# EAGLE design DOT-plus-SHIM (EAGLE 9.6.2)
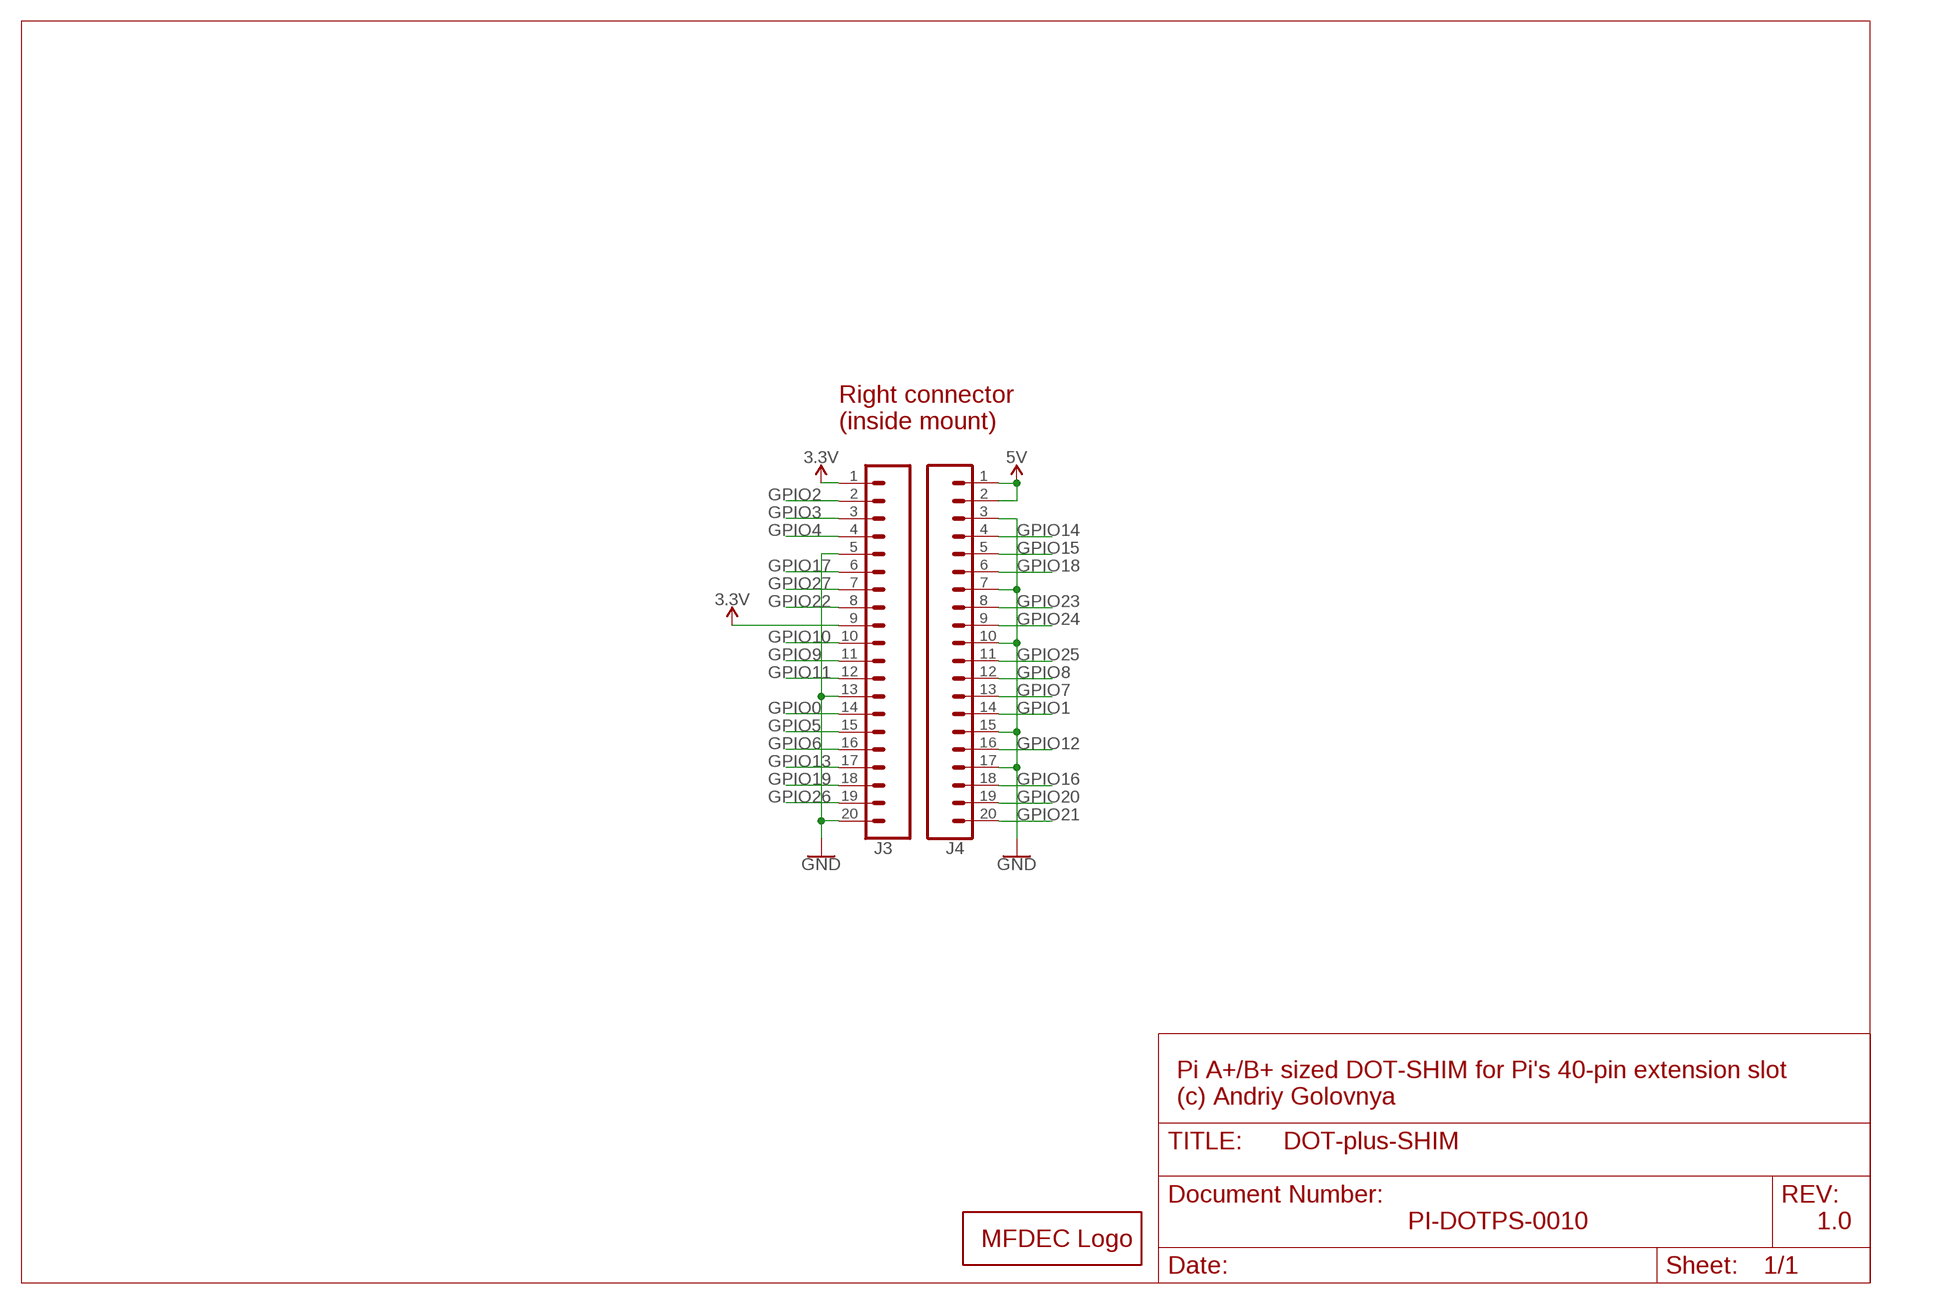
[diagram p0: schematic, sheet 1]

## Parts
J3  CONN_20LOCK  [1X20_LOCK]
J4  CONN_20LOCK  [1X20_LOCK]
LOGO1  MFDECLOGO_L_40MM  [MFDEC_L_40MM]

## Nets
3.3V: J3.1 J3.9
5V: J4.1 J4.2
GND: J3.5 J3.13 J3.20 J4.3 J4.7 J4.10 J4.15 J4.17
GPIO0: J3.14
GPIO1: J4.14
GPIO2: J3.2
GPIO3: J3.3
GPIO4: J3.4
GPIO5: J3.15
GPIO6: J3.16
GPIO7: J4.13
GPIO8: J4.12
GPIO9: J3.11
GPIO10: J3.10
GPIO11: J3.12
GPIO12: J4.16
GPIO13: J3.17
GPIO14: J4.4
GPIO15: J4.5
GPIO16: J4.18
GPIO17: J3.6
GPIO18: J4.6
GPIO19: J3.18
GPIO20: J4.19
GPIO21: J4.20
GPIO22: J3.8
GPIO23: J4.8
GPIO24: J4.9
GPIO25: J4.11
GPIO26: J3.19
GPIO27: J3.7

## Notes on the sheet
- Right connector
  (inside mount)
- Pi A+/B+ sized DOT-SHIM for Pi's 40-pin extension slot
  (c) Andriy Golovnya
- PI-DOTPS-0010 | 1.0

## Library data of the parts
J3 J4 = _my_locked_connectors:CONN_20: Multi connection point. Often used as Generic Header-pin footprint for 0.1 inch spaced/style header connections On any of the 0.1 inch spaced packages, you can populate with these: Break Away Headers - Straight <https://www.sparkfun.com/products/116> (PRT-00116) Break Away Male Headers - Right Angle <https://www.sparkfun.com/products/553> (PRT-00553) Female Headers <https://www.sparkfun.com/products/115> (PRT-00115) Break Away Headers - Machine Pin <https://www.sparkfun.com/products/117> (PRT-00117) Break Away Female Headers - Swiss Machine Pin <https://www.sparkfun.com/products/743> (PRT-00743) For SCREWTERMINALS and SPRING TERMINALS visit here: Screw Terimnals on SparkFun.com <https://www.sparkfun.com/search/results?term=Screw+Terminals> (5mm/3.5mm/2.54mm spacing) This device is also useful as a general connection point to wire up your design to another part of your project. Our various solder wires solder well into these plated through hole pads. Hook-Up Wire - Assortment (Stranded, 22 AWG) <https://www.sparkfun.com/products/11375> (PRT-11375) Hook-Up Wire - Assortment (Solid Core, 22 AWG) <https://www.sparkfun.com/products/11367> (PRT-11367) View the entire wire category on our website here <https://www.sparkfun.com/categories/141> Special notes: Molex polarized connector foot print use with SKU : PRT-08231 with associated crimp pins and housings. 1MM SMD Version SKU: PRT-10208 NOTES ON THE VARIANTS LOCK and LOCK_LONGPADS... This footprint was designed to help hold the alignment of a through-hole component (i.e. 6-pin header) while soldering it into place. You may notice that each hole has been shifted either up or down by 0.005 of an inch from it's more standard position (which is a perfectly straight line). This slight alteration caused the pins (the squares in the middle) to touch the edges of the holes. Because they are alternating, it causes a "brace" to hold the component in place. 0.005 has proven to be the perfect amount of "off-center" position when using our standard breakaway headers. Although looks a little odd when you look at the bare footprint, once you have a header in there, the alteration is very hard to notice. Also,if you push a header all the way into place, it is covered up entirely on the bottom side. Note about LOCK SPECIAL package: This is just like the LOCK variant in that the holes are staggared by 5 mil, but except for the last two holes. They are not altered from the "standard" footprint layout. This is used for a special purpose on the layout of our Graphic LCD Backpack. Make sure you want to use this device before selecting it for you project!
LOGO1 = _my_logos:MFDECLOGO: Midnight Fog - Digital Eye Candy LOGO

## Board
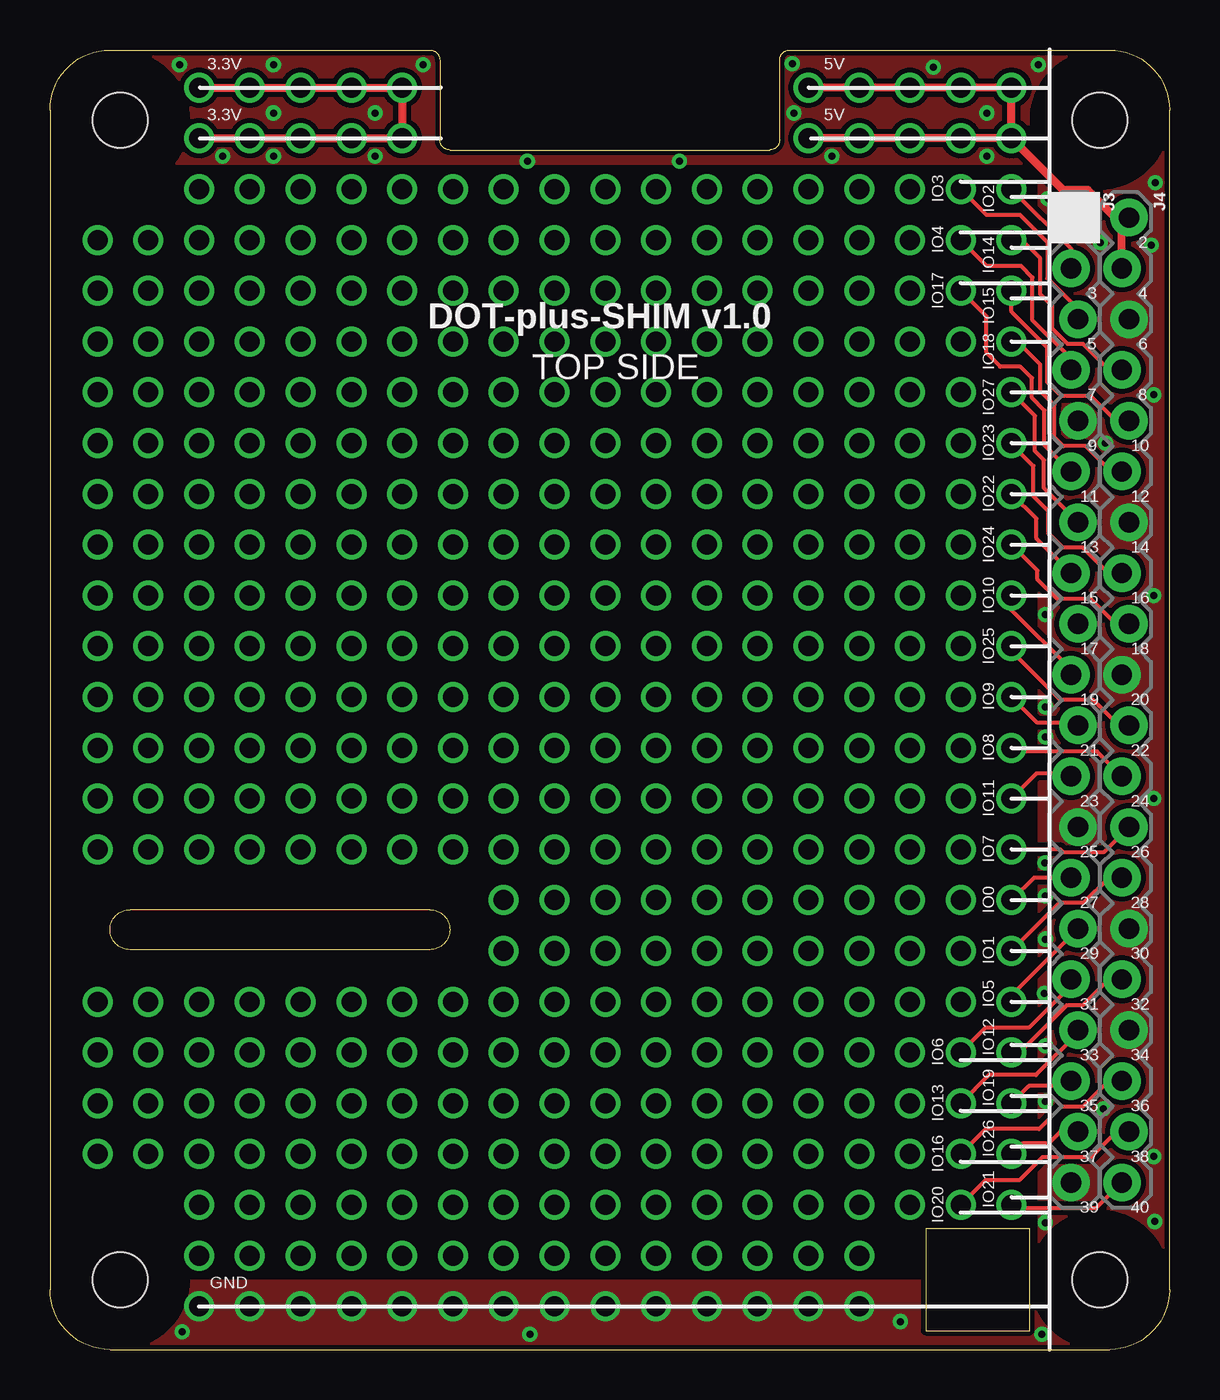
[diagram p1: board, top side]
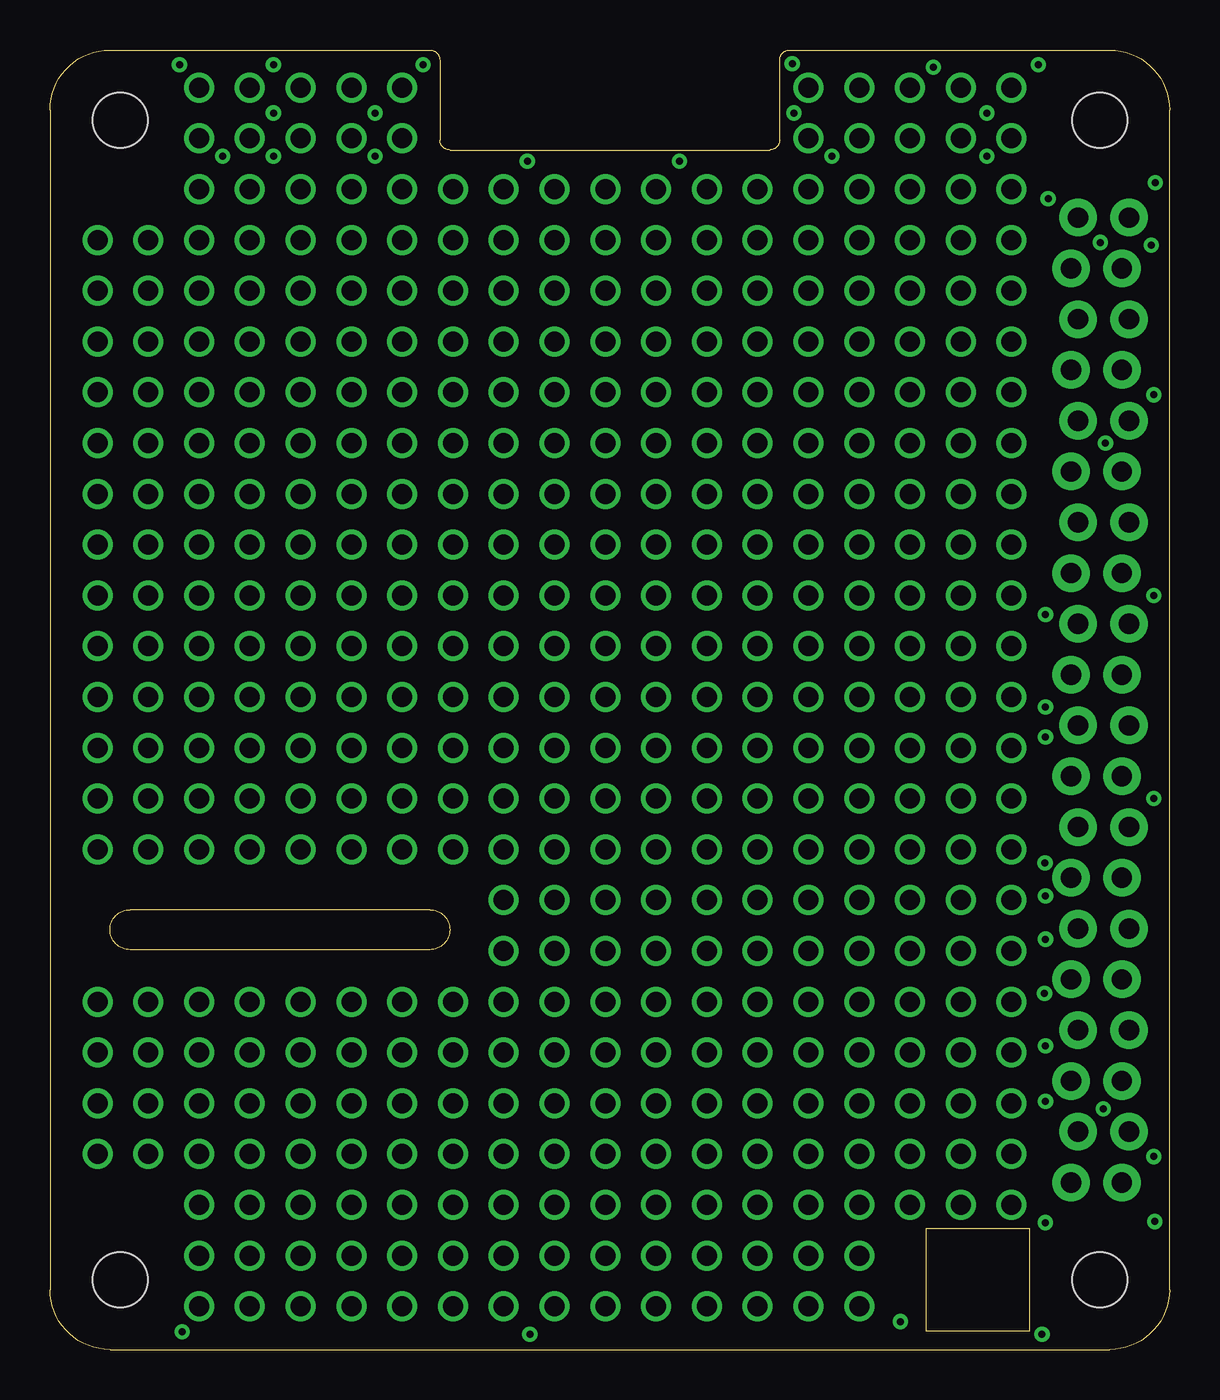
[diagram p2: board, inner layer Route2]
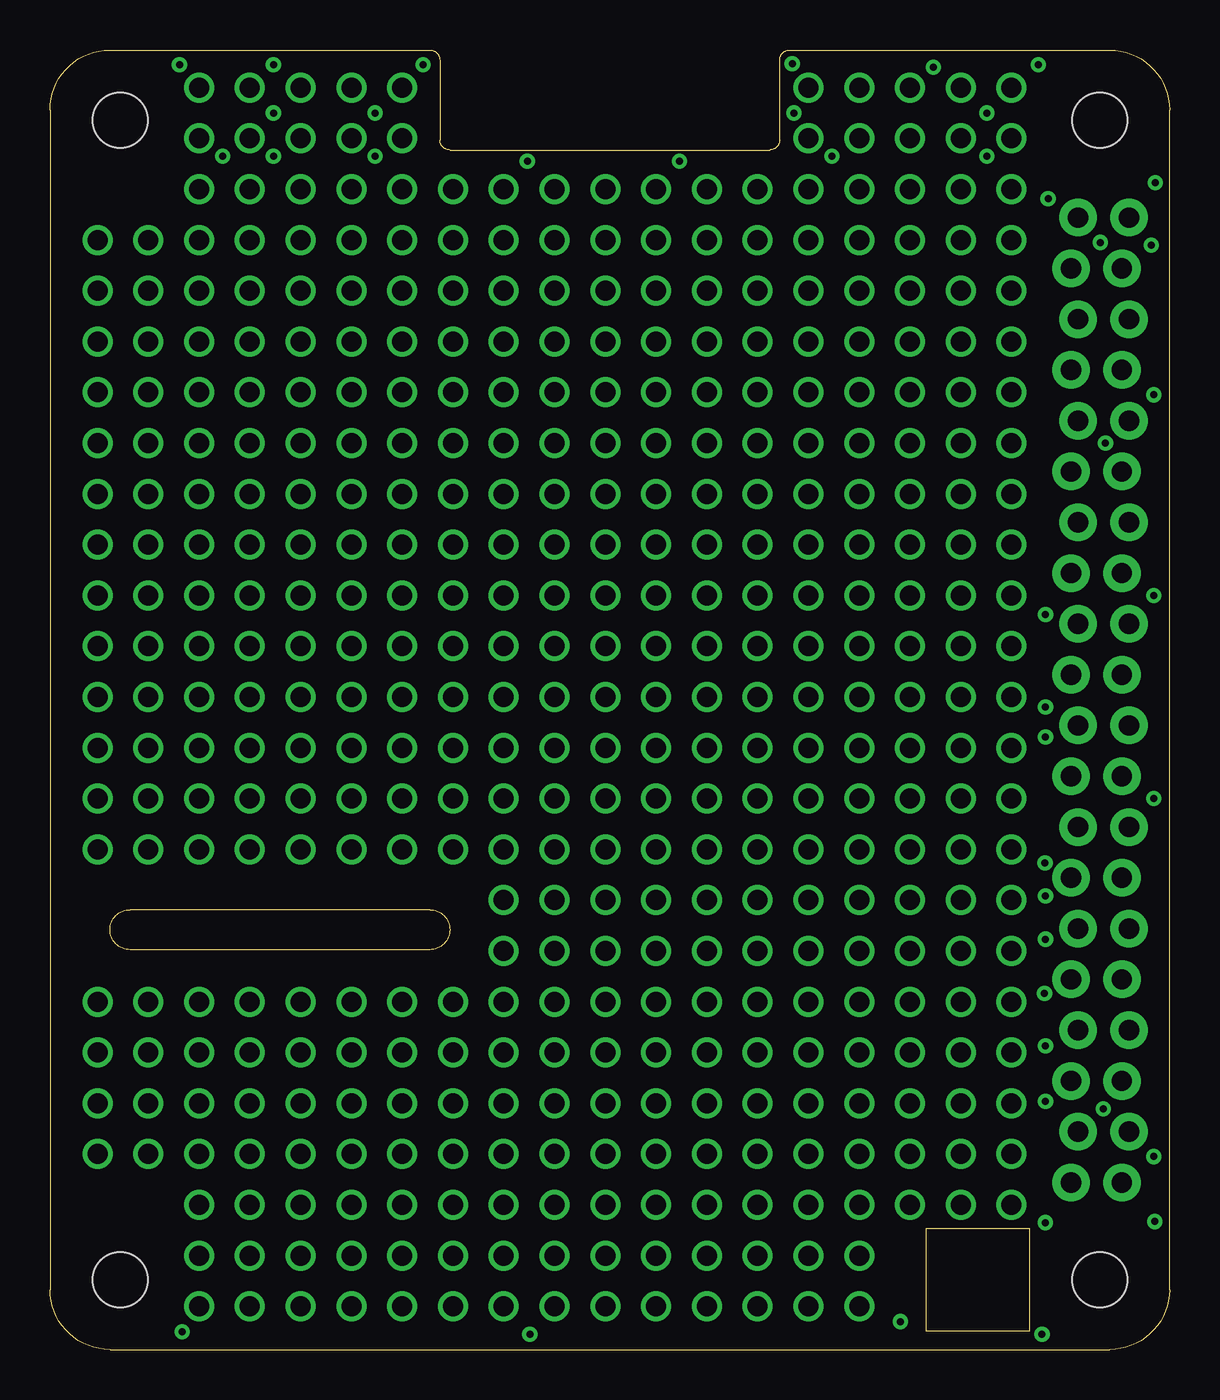
[diagram p3: board, inner layer Route15]
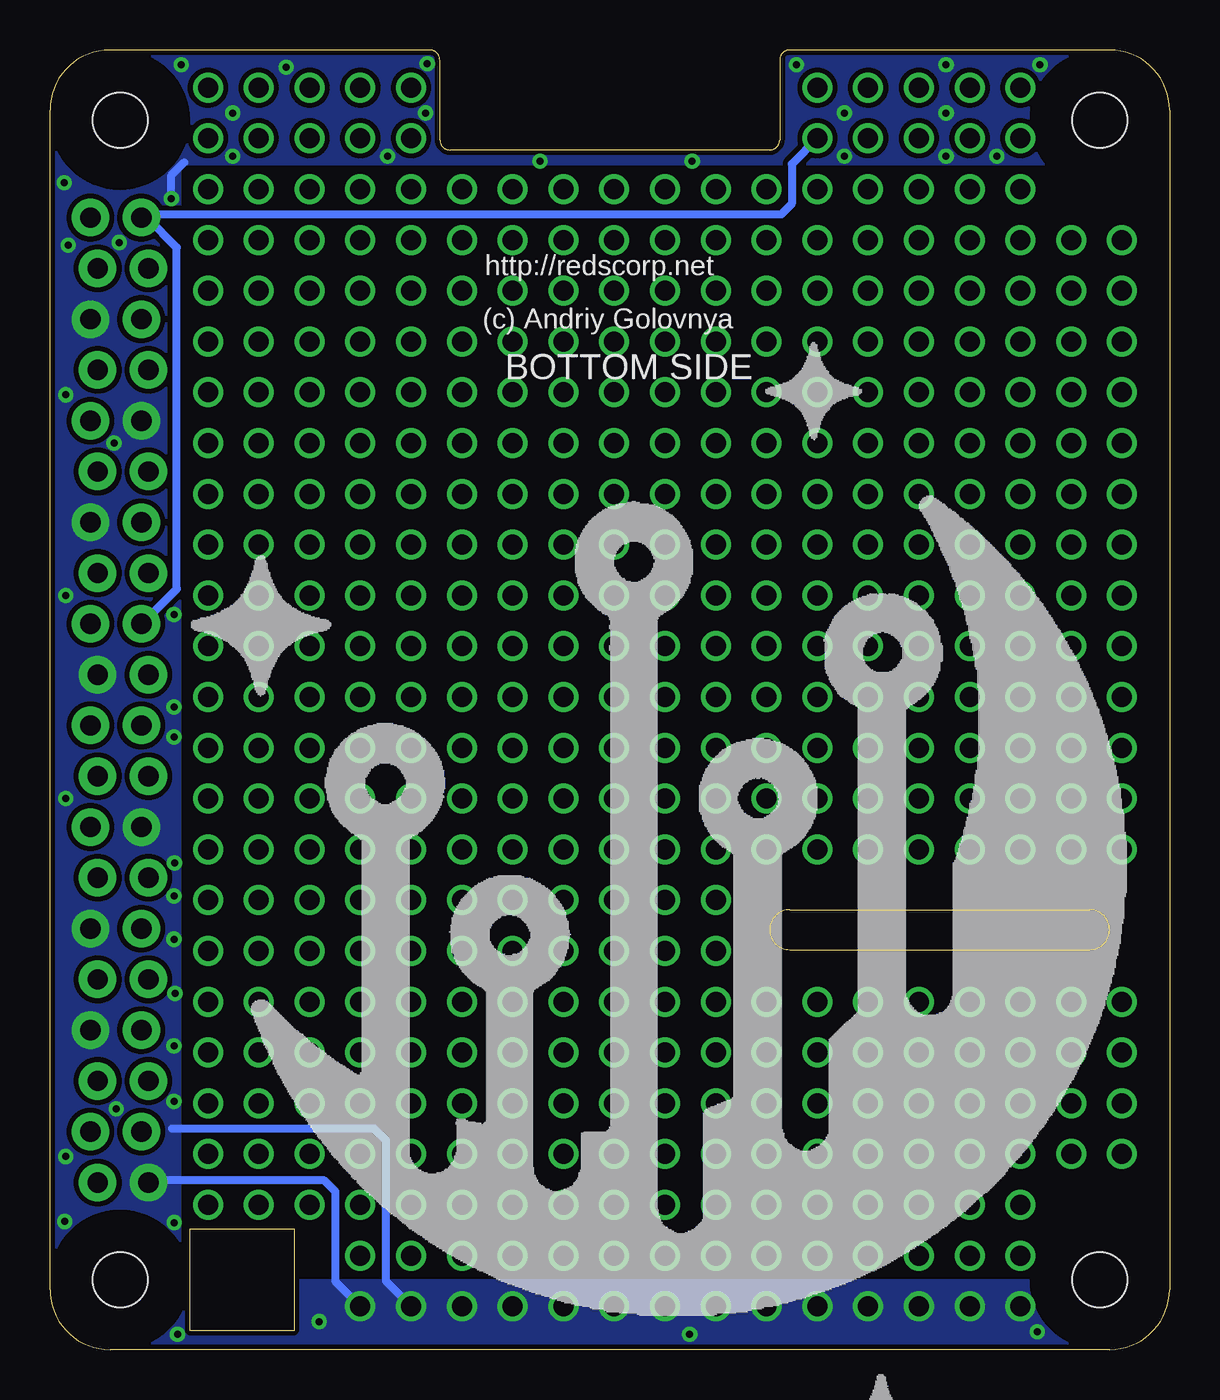
[diagram p4: board, bottom side, seen from below]

Size 56 x 65 mm. Coordinates in mm from the lower left corner, seen from the top.
Outline: 3,0 53,0 arc90 56,3 56,62 arc90 53,65 37,65 arc90 36.5,64.5 36.5,60.5 arc-90 36,60 20,60 arc-90 19.5,60.5 19.5,64.5 arc90 19,65 3,65 arc90 0,62 0,3 arc90 3,0
Outline: 43.8,0.95 49,0.95 49,6.05 43.8,6.05 43.8,0.95
Outline: 19,20 4,20 arc-180 4,22 19,22 arc-180 19,20
Copper layers (1*16): Top 0.035mm / dielectric 1.5mm / Bottom 0.035mm
Design rules "default *": minimum track width 6mil, minimum drill 0.35mm, track to track 6mil, track to pad 6mil, pad to pad 6mil, via to via 6mil, smd to smd 6mil, copper to edge 6mil, drill to drill 6mil, minimum pad ring 10mil, minimum via ring 8mil, stop-mask expansion 4mil, vias tented up to drill 20mil, thermal gap 10mil
Holes 2.75 mm at 3.5,3.5 52.5,3.5 3.5,61.5 52.5,61.5

### Footprints (pad centres in the part's own frame; a part is rotated, then mirrored left to right if it is on the bottom)
1X20_LOCK = drill 1.016 pad 1.88: 1 0,0.178; 2 2.54,-0.178; 3 5.08,0.178; 4 7.62,-0.178; 5 10.16,0.178; 6 12.7,-0.178; 7 15.24,0.178; 8 17.78,-0.178; 9 20.32,0.178; 10 22.86,-0.178; 11 25.4,0.178; 12 27.94,-0.178; 13 30.48,0.178; 14 33.02,-0.178; 15 35.56,0.178; 16 38.1,-0.178; 17 40.64,0.178; 18 43.18,-0.178; 19 45.72,0.178; 20 48.26,-0.178

### Placement (x,y rotation side)
J3  51.25,56.62 270 top
J4  53.79,56.62 270 top
LOGO1  -1.52,-10.03 90 bottom  (outside the outline)

### Tracks (layer width: path | path; a pad name or v marks a point on that pad's centre or on a via)
3.3V  (via drill 1)
  Top 0.406: v7.46,63.12 v10,63.12 v12.54,63.12 v15.08,63.12 v17.62,63.12 v17.62,60.58 v15.08,60.58 v12.54,60.58 v10,60.58 v7.46,60.58
  Bottom 0.406: J3.9 51.4,36.3 49.65,38.04 49.65,55.12 51.15,56.62 J3.1 51.28,56.77 19.43,56.77 18.9,57.3 18.9,59.3 v17.62,60.58
5V  (via drill 1)
  Top 0.406: J4.2 53.62,56.26 J4.1 53.29,56.62 51.91,57.99 50.69,57.99 v48.1,60.58 | v48.1,60.58 v45.56,60.58 v43.02,60.58 v40.48,60.58 v37.94,60.58 | v48.1,60.58 v48.1,63.12 v45.56,63.12 v43.02,63.12 v40.48,63.12 v37.94,63.12
GND  (via drill 0.35, 1)
  Bottom 0.406: v40.48,2.16 41.73,3.42 41.73,7.9 42.32,8.48 50.95,8.48 J3.20 | v37.94,2.16 39.19,3.41 39.19,10.46 39.78,11.05 49.91,11.05 | v49.93,57.56 49.93,58.73 49.28,59.38
  other vias: 30.32,2.16 27.78,2.16 25.24,2.16 22.7,2.16 20.16,2.16 17.62,2.16 15.08,2.16 32.86,2.16 35.4,2.16 7.46,2.16 10,2.16 12.54,2.16 55.26,6.4 49.62,0.76 49.44,64.26 55.29,58.37 37.13,64.31 49.8,36.75 49.8,30.63 49.8,22.68 49.8,20.52 49.8,15.19 52.54,55.37 52.8,45.34 52.7,12.04 55.08,55.24 55.21,47.75 55.21,37.72 55.21,27.56 55.21,9.65 49.8,32.13 49.77,24.33 49.75,17.81 49.8,12.42 37.21,61.85 39.12,59.69 46.86,61.85 46.86,59.69 44.2,64.14 6.48,64.26 8.64,59.69 16.26,61.85 18.67,64.26 16.26,59.69 11.18,61.85 11.18,64.26 11.18,59.69 31.5,59.44 23.88,59.44 6.6,0.89 42.55,1.4 24,0.76 49.78,6.35
  pour Top (isolate 0.254, no thermals): 49.49,59.31 -0.04,59.31 -0.04,65.15 56.23,65.15 56.23,0 -0.04,0 -0.04,3.43 49.49,3.43
  pour Bottom (isolate 0.254, no thermals): -0.04,59.31 -0.04,65.15 56.23,65.15 56.23,0 -0.04,0 -0.04,3.43 49.49,3.43 49.49,59.31
GND1
  cutout Top: 52.5,0 arc-180 52.5,7 arc-180
  cutout Route2: 52.5,0 arc-180 52.5,7 arc-180
  cutout Route15: 52.5,0 arc-180 52.5,7 arc-180
  cutout Bottom: 52.5,0 arc-180 52.5,7 arc-180
GND2
  cutout Top: 3.5,58 arc-180 3.5,65 arc-180
  cutout Route2: 3.5,58 arc-180 3.5,65 arc-180
  cutout Route15: 3.5,58 arc-180 3.5,65 arc-180
  cutout Bottom: 3.5,58 arc-180 3.5,65 arc-180
GND3
  cutout Top: 52.5,58 arc-180 52.5,65 arc-180
  cutout Route2: 52.5,58 arc-180 52.5,65 arc-180
  cutout Route15: 52.5,58 arc-180 52.5,65 arc-180
  cutout Bottom: 52.5,58 arc-180 52.5,65 arc-180
GND4
  cutout Top: 3.5,0 arc-180 3.5,7 arc-180
  cutout Route2: 3.5,0 arc-180 3.5,7 arc-180
  cutout Route15: 3.5,0 arc-180 3.5,7 arc-180
  cutout Bottom: 3.5,0 arc-180 3.5,7 arc-180
GPIO0  (via drill 1)
  Top 0.203: J3.14 49.21,23.59 v48.1,22.48
GPIO1  (via drill 1)
  Top 0.203: J4.14 52.96,23.59 51.69,22.33 50.49,22.33 v48.1,19.94
GPIO2  (via drill 1)
  Top 0.203: v48.1,58.04 51.08,55.06 J3.2
GPIO3  (via drill 1)
  Top 0.203: v45.56,58.04 46.84,56.76 48.51,56.76 49.88,55.39 49.88,53.58 51.43,52.03 J3.3
GPIO4  (via drill 1)
  Top 0.203: J3.4 51.08,49.55 49.15,51.48 49.15,53.62 48.58,54.19 46.87,54.19 v45.56,55.5
GPIO5  (via drill 1)
  Top 0.203: J3.15 48.1,17.72 v48.1,17.4
GPIO6  (via drill 1)
  Top 0.203: J3.16 51.08,18.21 48.96,16.09 46.79,16.09 v45.56,14.86
GPIO7  (via drill 1)
  Top 0.203: v48.1,25.02 50.53,25.02 50.68,24.86 52.7,24.86 J4.13
GPIO8  (via drill 1)
  Top 0.203: v48.1,30.1 v48.1,30.09 48.27,29.92 52.37,29.92 J4.12
GPIO9  (via drill 1)
  Top 0.203: J3.11 51.3,31.34 49.39,31.34 v48.1,32.64
GPIO10  (via drill 1)
  Top 0.203: v48.1,37.72 48.1,36.99 51.08,34.01 J3.10
GPIO11  (via drill 1)
  Top 0.203: J3.12 50.95,28.8 49.34,28.8 v48.1,27.56
GPIO12  (via drill 1)
  Top 0.203: J4.16 52.96,18.52 51.66,17.22 50.86,17.22 48.5,14.86 v48.1,14.86
GPIO13  (via drill 1)
  Top 0.203: J3.17 51.43,15.85 49.31,13.73 46.97,13.73 v45.56,12.32
GPIO14  (via drill 1)
  Top 0.203: v48.1,55.5 48.61,55.5 49.53,54.58 49.53,52.8 50.13,52.2 50.13,51.07 50.91,50.29 51.69,50.29 52.98,48.99 J4.4
GPIO15  (via drill 1)
  Top 0.203: J4.5 53.31,46.45 52.07,47.7 50.58,47.7 49.88,48.4 49.88,50.12 48.1,51.9 v48.1,52.96
GPIO16  (via drill 1)
  Top 0.203: J4.18 52.96,13.44 51.66,12.14 50.58,12.14 49.48,11.04 46.82,11.04 v45.56,9.78
GPIO17  (via drill 1)
  Top 0.203: J3.6 49.75,45.24 49.75,46.97 49.11,47.61 49.11,48.59 48.54,49.16 47.53,49.16 46.84,49.85 46.84,51.68 v45.56,52.96
GPIO18  (via drill 1)
  Top 0.203: v48.1,50.42 48.38,50.42 49.52,49.28 49.52,47.96 50.24,47.24 50.24,45.63 50.68,45.19 51.81,45.19 53.08,43.91 J4.6
GPIO19  (via drill 1)
  Top 0.203: J3.18 50.82,13.18 48.97,13.18 v48.11,12.32 v48.1,12.32
GPIO20  (via drill 1)
  Top 0.203: J4.19 53.34,10.89 52.07,9.62 49.64,9.62 48.49,8.47 46.79,8.47 v45.56,7.24
GPIO21  (via drill 1)
  Top 0.203: v48.1,7.24 48.28,7.06 52.32,7.06 J4.20
GPIO22  (via drill 1)
  Top 0.203: J3.8 49.34,40.57 49.34,41.55 v48.1,42.8
GPIO23  (via drill 1)
  Top 0.203: J4.8 52.93,38.84 51.66,40.1 50.66,40.1 49.93,40.83 49.93,41.94 49.19,42.68 49.19,44.2 48.1,45.29 v48.1,45.34
GPIO24  (via drill 1)
  Top 0.203: J4.9 53.31,36.3 52.07,37.54 50.38,37.54 49.4,38.52 49.4,38.96 v48.1,40.26
GPIO25  (via drill 1)
  Top 0.203: J4.11 53.46,31.21 52.19,32.48 50.53,32.48 48.1,34.91 v48.1,35.17 v48.1,35.18
GPIO26  (via drill 1)
  Top 0.203: J3.19 50.54,10.89 49.95,10.31 48.63,10.31 v48.1,9.78
GPIO27  (via drill 1)
  Top 0.203: J3.7 49.72,43.08 49.72,44.48 49.27,44.94 49.27,46.71 v48.1,47.88
N$1  (via drill 1)
  other vias: 25.24,7.24
N$2  (via drill 1)
  other vias: 25.24,9.78
N$3  (via drill 1)
  other vias: 25.24,12.32
N$4  (via drill 1)
  other vias: 25.24,14.86
N$5  (via drill 1)
  other vias: 25.24,17.4
N$6  (via drill 1)
  other vias: 25.24,19.94
N$7  (via drill 1)
  other vias: 25.24,22.48
N$8  (via drill 1)
  other vias: 25.24,25.02
N$9  (via drill 1)
  other vias: 25.24,27.56
N$10  (via drill 1)
  other vias: 25.24,30.1
N$11  (via drill 1)
  other vias: 25.24,32.64
N$12  (via drill 1)
  other vias: 25.24,35.18
N$13  (via drill 1)
  other vias: 25.24,37.72
N$14  (via drill 1)
  other vias: 25.24,40.26
N$15  (via drill 1)
  other vias: 25.24,42.8
N$16  (via drill 1)
  other vias: 25.24,45.34
N$17  (via drill 1)
  other vias: 25.24,47.88
N$18  (via drill 1)
  other vias: 25.24,50.42
N$19  (via drill 1)
  other vias: 25.24,52.96
N$20  (via drill 1)
  other vias: 25.24,55.5
N$21  (via drill 1)
  other vias: 25.24,58.04
N$22  (via drill 1)
  other vias: 22.7,7.24
N$23  (via drill 1)
  other vias: 22.7,9.78
N$24  (via drill 1)
  other vias: 22.7,12.32
N$25  (via drill 1)
  other vias: 22.7,14.86
N$26  (via drill 1)
  other vias: 22.7,17.4
N$27  (via drill 1)
  other vias: 22.7,19.94
N$28  (via drill 1)
  other vias: 22.7,22.48
N$29  (via drill 1)
  other vias: 22.7,25.02
N$30  (via drill 1)
  other vias: 22.7,27.56
N$31  (via drill 1)
  other vias: 22.7,30.1
N$32  (via drill 1)
  other vias: 45.56,17.4
N$33  (via drill 1)
  other vias: 45.56,19.94
N$34  (via drill 1)
  other vias: 45.56,22.48
N$35  (via drill 1)
  other vias: 45.56,25.02
N$36  (via drill 1)
  other vias: 45.56,27.56
N$37  (via drill 1)
  other vias: 45.56,30.1
N$38  (via drill 1)
  other vias: 45.56,32.64
N$39  (via drill 1)
  other vias: 45.56,35.18
N$40  (via drill 1)
  other vias: 45.56,37.72
N$41  (via drill 1)
  other vias: 45.56,40.26
N$42  (via drill 1)
  other vias: 45.56,42.8
N$43  (via drill 1)
  other vias: 45.56,45.34
N$44  (via drill 1)
  other vias: 45.56,47.88
N$45  (via drill 1)
  other vias: 45.56,50.42
N$46  (via drill 1)
  other vias: 22.7,32.64
N$47  (via drill 1)
  other vias: 22.7,35.18
N$48  (via drill 1)
  other vias: 22.7,37.72
N$49  (via drill 1)
  other vias: 22.7,40.26
N$50  (via drill 1)
  other vias: 22.7,42.8
N$51  (via drill 1)
  other vias: 22.7,45.34
N$52  (via drill 1)
  other vias: 22.7,47.88
N$53  (via drill 1)
  other vias: 43.02,7.24
N$54  (via drill 1)
  other vias: 43.02,9.78
N$55  (via drill 1)
  other vias: 43.02,12.32
N$56  (via drill 1)
  other vias: 43.02,14.86
N$57  (via drill 1)
  other vias: 43.02,17.4
N$58  (via drill 1)
  other vias: 43.02,19.94
N$59  (via drill 1)
  other vias: 43.02,22.48
N$60  (via drill 1)
  other vias: 43.02,25.02
N$61  (via drill 1)
  other vias: 43.02,27.56
N$62  (via drill 1)
  other vias: 43.02,30.1
N$63  (via drill 1)
  other vias: 43.02,32.64
N$64  (via drill 1)
  other vias: 43.02,35.18
N$65  (via drill 1)
  other vias: 43.02,37.72
N$66  (via drill 1)
  other vias: 43.02,40.26
N$67  (via drill 1)
  other vias: 43.02,42.8
N$68  (via drill 1)
  other vias: 43.02,45.34
N$69  (via drill 1)
  other vias: 43.02,47.88
N$70  (via drill 1)
  other vias: 43.02,50.42
N$71  (via drill 1)
  other vias: 43.02,52.96
N$72  (via drill 1)
  other vias: 43.02,55.5
N$73  (via drill 1)
  other vias: 43.02,58.04
N$74  (via drill 1)
  other vias: 22.7,50.42
N$75  (via drill 1)
  other vias: 22.7,52.96
N$76  (via drill 1)
  other vias: 22.7,55.5
N$77  (via drill 1)
  other vias: 22.7,58.04
N$78  (via drill 1)
  other vias: 40.48,7.24
N$79  (via drill 1)
  other vias: 40.48,9.78
N$80  (via drill 1)
  other vias: 40.48,12.32
N$81  (via drill 1)
  other vias: 40.48,14.86
N$82  (via drill 1)
  other vias: 40.48,17.4
N$83  (via drill 1)
  other vias: 40.48,19.94
N$84  (via drill 1)
  other vias: 40.48,22.48
N$85  (via drill 1)
  other vias: 40.48,25.02
N$86  (via drill 1)
  other vias: 40.48,27.56
N$87  (via drill 1)
  other vias: 40.48,30.1
N$88  (via drill 1)
  other vias: 40.48,32.64
N$89  (via drill 1)
  other vias: 40.48,35.18
N$90  (via drill 1)
  other vias: 40.48,37.72
N$91  (via drill 1)
  other vias: 40.48,40.26
N$92  (via drill 1)
  other vias: 40.48,42.8
N$93  (via drill 1)
  other vias: 40.48,45.34
N$94  (via drill 1)
  other vias: 40.48,47.88
N$95  (via drill 1)
  other vias: 40.48,50.42
N$96  (via drill 1)
  other vias: 40.48,52.96
N$97  (via drill 1)
  other vias: 40.48,55.5
N$98  (via drill 1)
  other vias: 40.48,58.04
N$99  (via drill 1)
  other vias: 20.16,7.24
N$100  (via drill 1)
  other vias: 20.16,9.78
N$101  (via drill 1)
  other vias: 20.16,12.32
N$102  (via drill 1)
  other vias: 20.16,14.86
N$103  (via drill 1)
  other vias: 37.94,7.24
N$104  (via drill 1)
  other vias: 37.94,9.78
N$105  (via drill 1)
  other vias: 37.94,12.32
N$106  (via drill 1)
  other vias: 37.94,14.86
N$107  (via drill 1)
  other vias: 37.94,17.4
N$108  (via drill 1)
  other vias: 37.94,19.94
N$109  (via drill 1)
  other vias: 37.94,22.48
N$110  (via drill 1)
  other vias: 37.94,25.02
N$111  (via drill 1)
  other vias: 37.94,27.56
N$112  (via drill 1)
  other vias: 37.94,30.1
N$113  (via drill 1)
  other vias: 37.94,32.64
N$114  (via drill 1)
  other vias: 37.94,35.18
N$115  (via drill 1)
  other vias: 37.94,37.72
N$116  (via drill 1)
  other vias: 37.94,40.26
N$117  (via drill 1)
  other vias: 37.94,42.8
N$118  (via drill 1)
  other vias: 37.94,45.34
N$119  (via drill 1)
  other vias: 37.94,47.88
N$120  (via drill 1)
  other vias: 37.94,50.42
N$121  (via drill 1)
  other vias: 37.94,52.96
N$122  (via drill 1)
  other vias: 37.94,55.5
N$123  (via drill 1)
  other vias: 37.94,58.04
N$124  (via drill 1)
  other vias: 20.16,17.4
N$127  (via drill 1)
  other vias: 20.16,25.02
N$128  (via drill 1)
  other vias: 35.4,7.24
N$129  (via drill 1)
  other vias: 35.4,9.78
N$130  (via drill 1)
  other vias: 35.4,12.32
N$131  (via drill 1)
  other vias: 35.4,14.86
N$132  (via drill 1)
  other vias: 35.4,17.4
N$133  (via drill 1)
  other vias: 35.4,19.94
N$134  (via drill 1)
  other vias: 35.4,22.48
N$135  (via drill 1)
  other vias: 35.4,25.02
N$136  (via drill 1)
  other vias: 35.4,27.56
N$137  (via drill 1)
  other vias: 35.4,30.1
N$138  (via drill 1)
  other vias: 35.4,32.64
N$139  (via drill 1)
  other vias: 35.4,35.18
N$140  (via drill 1)
  other vias: 35.4,37.72
N$141  (via drill 1)
  other vias: 35.4,40.26
N$142  (via drill 1)
  other vias: 35.4,42.8
N$143  (via drill 1)
  other vias: 35.4,45.34
N$144  (via drill 1)
  other vias: 35.4,47.88
N$145  (via drill 1)
  other vias: 35.4,50.42
N$146  (via drill 1)
  other vias: 35.4,52.96
N$147  (via drill 1)
  other vias: 35.4,55.5
N$148  (via drill 1)
  other vias: 35.4,58.04
N$149  (via drill 1)
  other vias: 20.16,27.56
N$150  (via drill 1)
  other vias: 20.16,30.1
N$151  (via drill 1)
  other vias: 20.16,32.64
N$152  (via drill 1)
  other vias: 20.16,35.18
N$153  (via drill 1)
  other vias: 32.86,7.24
N$154  (via drill 1)
  other vias: 32.86,9.78
N$155  (via drill 1)
  other vias: 32.86,12.32
N$156  (via drill 1)
  other vias: 32.86,14.86
N$157  (via drill 1)
  other vias: 32.86,17.4
N$158  (via drill 1)
  other vias: 32.86,19.94
N$159  (via drill 1)
  other vias: 32.86,22.48
N$160  (via drill 1)
  other vias: 32.86,25.02
N$161  (via drill 1)
  other vias: 32.86,27.56
N$162  (via drill 1)
  other vias: 32.86,30.1
N$163  (via drill 1)
  other vias: 32.86,32.64
N$164  (via drill 1)
  other vias: 32.86,35.18
N$165  (via drill 1)
  other vias: 32.86,37.72
N$166  (via drill 1)
  other vias: 32.86,40.26
N$167  (via drill 1)
  other vias: 32.86,42.8
N$168  (via drill 1)
  other vias: 32.86,45.34
N$169  (via drill 1)
  other vias: 32.86,47.88
N$170  (via drill 1)
  other vias: 32.86,50.42
N$171  (via drill 1)
  other vias: 32.86,52.96
N$172  (via drill 1)
  other vias: 32.86,55.5
N$173  (via drill 1)
  other vias: 32.86,58.04
N$174  (via drill 1)
  other vias: 20.16,37.72
N$175  (via drill 1)
  other vias: 20.16,40.26
N$176  (via drill 1)
  other vias: 20.16,42.8
N$177  (via drill 1)
  other vias: 20.16,45.34
N$178  (via drill 1)
  other vias: 30.32,7.24
N$179  (via drill 1)
  other vias: 30.32,9.78
N$180  (via drill 1)
  other vias: 30.32,12.32
N$181  (via drill 1)
  other vias: 30.32,14.86
N$182  (via drill 1)
  other vias: 30.32,17.4
N$183  (via drill 1)
  other vias: 30.32,19.94
N$184  (via drill 1)
  other vias: 30.32,22.48
N$185  (via drill 1)
  other vias: 30.32,25.02
N$186  (via drill 1)
  other vias: 30.32,27.56
N$187  (via drill 1)
  other vias: 30.32,30.1
N$188  (via drill 1)
  other vias: 30.32,32.64
N$189  (via drill 1)
  other vias: 30.32,35.18
N$190  (via drill 1)
  other vias: 30.32,37.72
N$191  (via drill 1)
  other vias: 30.32,40.26
N$192  (via drill 1)
  other vias: 30.32,42.8
N$193  (via drill 1)
  other vias: 30.32,45.34
N$194  (via drill 1)
  other vias: 30.32,47.88
N$195  (via drill 1)
  other vias: 30.32,50.42
N$196  (via drill 1)
  other vias: 30.32,52.96
N$197  (via drill 1)
  other vias: 30.32,55.5
N$198  (via drill 1)
  other vias: 30.32,58.04
N$199  (via drill 1)
  other vias: 20.16,47.88
N$200  (via drill 1)
  other vias: 20.16,50.42
N$201  (via drill 1)
  other vias: 20.16,52.96
N$202  (via drill 1)
  other vias: 20.16,55.5
N$203  (via drill 1)
  other vias: 27.78,7.24
N$204  (via drill 1)
  other vias: 27.78,9.78
N$205  (via drill 1)
  other vias: 27.78,12.32
N$206  (via drill 1)
  other vias: 27.78,14.86
N$207  (via drill 1)
  other vias: 27.78,17.4
N$208  (via drill 1)
  other vias: 27.78,19.94
N$209  (via drill 1)
  other vias: 27.78,22.48
N$210  (via drill 1)
  other vias: 27.78,25.02
N$211  (via drill 1)
  other vias: 27.78,27.56
N$212  (via drill 1)
  other vias: 27.78,30.1
N$213  (via drill 1)
  other vias: 27.78,32.64
N$214  (via drill 1)
  other vias: 27.78,35.18
N$215  (via drill 1)
  other vias: 27.78,37.72
N$216  (via drill 1)
  other vias: 27.78,40.26
N$217  (via drill 1)
  other vias: 27.78,42.8
N$218  (via drill 1)
  other vias: 27.78,45.34
N$219  (via drill 1)
  other vias: 27.78,47.88
N$220  (via drill 1)
  other vias: 27.78,50.42
N$221  (via drill 1)
  other vias: 27.78,52.96
N$222  (via drill 1)
  other vias: 27.78,55.5
N$223  (via drill 1)
  other vias: 27.78,58.04
N$224  (via drill 1)
  other vias: 20.16,58.04
N$225  (via drill 1)
  other vias: 17.62,7.24
N$226  (via drill 1)
  other vias: 17.62,9.78
N$227  (via drill 1)
  other vias: 17.62,12.32
N$228  (via drill 1)
  other vias: 17.62,14.86
N$229  (via drill 1)
  other vias: 17.62,17.4
N$232  (via drill 1)
  other vias: 17.62,25.02
N$233  (via drill 1)
  other vias: 17.62,27.56
N$234  (via drill 1)
  other vias: 17.62,30.1
N$235  (via drill 1)
  other vias: 17.62,32.64
N$236  (via drill 1)
  other vias: 17.62,35.18
N$237  (via drill 1)
  other vias: 17.62,37.72
N$238  (via drill 1)
  other vias: 17.62,40.26
N$239  (via drill 1)
  other vias: 17.62,42.8
N$240  (via drill 1)
  other vias: 17.62,45.34
N$241  (via drill 1)
  other vias: 17.62,47.88
N$242  (via drill 1)
  other vias: 17.62,50.42
N$243  (via drill 1)
  other vias: 17.62,52.96
N$244  (via drill 1)
  other vias: 17.62,55.5
N$245  (via drill 1)
  other vias: 17.62,58.04
N$246  (via drill 1)
  other vias: 15.08,7.24
N$247  (via drill 1)
  other vias: 15.08,9.78
N$248  (via drill 1)
  other vias: 15.08,12.32
N$249  (via drill 1)
  other vias: 15.08,14.86
N$250  (via drill 1)
  other vias: 15.08,17.4
N$253  (via drill 1)
  other vias: 15.08,25.02
N$254  (via drill 1)
  other vias: 15.08,27.56
N$255  (via drill 1)
  other vias: 15.08,30.1
N$256  (via drill 1)
  other vias: 15.08,32.64
N$257  (via drill 1)
  other vias: 15.08,35.18
N$258  (via drill 1)
  other vias: 15.08,37.72
N$259  (via drill 1)
  other vias: 15.08,40.26
N$260  (via drill 1)
  other vias: 15.08,42.8
N$261  (via drill 1)
  other vias: 15.08,45.34
N$262  (via drill 1)
  other vias: 15.08,47.88
N$263  (via drill 1)
  other vias: 15.08,50.42
N$264  (via drill 1)
  other vias: 15.08,52.96
N$265  (via drill 1)
  other vias: 15.08,55.5
N$266  (via drill 1)
  other vias: 15.08,58.04
N$267  (via drill 1)
  other vias: 12.54,7.24
N$268  (via drill 1)
  other vias: 12.54,9.78
N$269  (via drill 1)
  other vias: 12.54,12.32
N$270  (via drill 1)
  other vias: 12.54,14.86
N$271  (via drill 1)
  other vias: 12.54,17.4
N$274  (via drill 1)
  other vias: 12.54,25.02
N$275  (via drill 1)
  other vias: 12.54,27.56
N$276  (via drill 1)
  other vias: 12.54,30.1
N$277  (via drill 1)
  other vias: 12.54,32.64
N$278  (via drill 1)
  other vias: 12.54,35.18
N$279  (via drill 1)
  other vias: 12.54,37.72
N$280  (via drill 1)
  other vias: 12.54,40.26
N$281  (via drill 1)
  other vias: 12.54,42.8
N$282  (via drill 1)
  other vias: 12.54,45.34
N$283  (via drill 1)
  other vias: 12.54,47.88
N$284  (via drill 1)
  other vias: 12.54,50.42
N$285  (via drill 1)
  other vias: 12.54,52.96
N$286  (via drill 1)
  other vias: 12.54,55.5
N$287  (via drill 1)
  other vias: 12.54,58.04
N$288  (via drill 1)
  other vias: 10,7.24
N$289  (via drill 1)
  other vias: 10,9.78
N$290  (via drill 1)
  other vias: 10,12.32
N$291  (via drill 1)
  other vias: 10,14.86
N$292  (via drill 1)
  other vias: 10,17.4
N$295  (via drill 1)
  other vias: 10,25.02
N$296  (via drill 1)
  other vias: 10,27.56
N$297  (via drill 1)
  other vias: 10,30.1
N$298  (via drill 1)
  other vias: 10,32.64
N$299  (via drill 1)
  other vias: 10,35.18
N$300  (via drill 1)
  other vias: 10,37.72
N$301  (via drill 1)
  other vias: 10,40.26
N$302  (via drill 1)
  other vias: 10,42.8
N$303  (via drill 1)
  other vias: 10,45.34
N$304  (via drill 1)
  other vias: 10,47.88
N$305  (via drill 1)
  other vias: 10,50.42
N$306  (via drill 1)
  other vias: 10,52.96
N$307  (via drill 1)
  other vias: 10,55.5
N$308  (via drill 1)
  other vias: 10,58.04
N$309  (via drill 1)
  other vias: 7.46,7.24
N$310  (via drill 1)
  other vias: 7.46,9.78
N$311  (via drill 1)
  other vias: 7.46,12.32
N$312  (via drill 1)
  other vias: 7.46,14.86
N$313  (via drill 1)
  other vias: 7.46,17.4
N$316  (via drill 1)
  other vias: 7.46,25.02
N$317  (via drill 1)
  other vias: 7.46,27.56
N$318  (via drill 1)
  other vias: 7.46,30.1
N$319  (via drill 1)
  other vias: 7.46,32.64
N$320  (via drill 1)
  other vias: 7.46,35.18
N$321  (via drill 1)
  other vias: 7.46,37.72
N$322  (via drill 1)
  other vias: 7.46,40.26
N$323  (via drill 1)
  other vias: 7.46,42.8
N$324  (via drill 1)
  other vias: 7.46,45.34
N$325  (via drill 1)
  other vias: 7.46,47.88
N$326  (via drill 1)
  other vias: 7.46,50.42
N$327  (via drill 1)
  other vias: 7.46,52.96
N$328  (via drill 1)
  other vias: 7.46,55.5
N$329  (via drill 1)
  other vias: 7.46,58.04
N$331  (via drill 1)
  other vias: 4.92,9.78
N$332  (via drill 1)
  other vias: 4.92,12.32
N$333  (via drill 1)
  other vias: 4.92,14.86
N$334  (via drill 1)
  other vias: 4.92,17.4
N$337  (via drill 1)
  other vias: 4.92,25.02
N$338  (via drill 1)
  other vias: 4.92,27.56
N$339  (via drill 1)
  other vias: 4.92,30.1
N$340  (via drill 1)
  other vias: 4.92,32.64
N$341  (via drill 1)
  other vias: 4.92,35.18
N$342  (via drill 1)
  other vias: 4.92,37.72
N$343  (via drill 1)
  other vias: 4.92,40.26
N$344  (via drill 1)
  other vias: 4.92,42.8
N$345  (via drill 1)
  other vias: 4.92,45.34
N$346  (via drill 1)
  other vias: 4.92,47.88
N$347  (via drill 1)
  other vias: 4.92,50.42
N$348  (via drill 1)
  other vias: 4.92,52.96
N$349  (via drill 1)
  other vias: 4.92,55.5
N$352  (via drill 1)
  other vias: 2.38,9.78
N$353  (via drill 1)
  other vias: 2.38,12.32
N$354  (via drill 1)
  other vias: 2.38,14.86
N$355  (via drill 1)
  other vias: 2.38,17.4
N$358  (via drill 1)
  other vias: 2.38,25.02
N$359  (via drill 1)
  other vias: 2.38,27.56
N$360  (via drill 1)
  other vias: 2.38,30.1
N$361  (via drill 1)
  other vias: 2.38,32.64
N$362  (via drill 1)
  other vias: 2.38,35.18
N$363  (via drill 1)
  other vias: 2.38,37.72
N$364  (via drill 1)
  other vias: 2.38,40.26
N$365  (via drill 1)
  other vias: 2.38,42.8
N$366  (via drill 1)
  other vias: 2.38,45.34
N$367  (via drill 1)
  other vias: 2.38,47.88
N$368  (via drill 1)
  other vias: 2.38,50.42
N$369  (via drill 1)
  other vias: 2.38,52.96
N$370  (via drill 1)
  other vias: 2.38,55.5
N$372  (via drill 1)
  other vias: 40.48,4.7
N$373  (via drill 1)
  other vias: 37.94,4.7
N$374  (via drill 1)
  other vias: 35.4,4.7
N$375  (via drill 1)
  other vias: 32.86,4.7
N$376  (via drill 1)
  other vias: 30.32,4.7
N$377  (via drill 1)
  other vias: 27.78,4.7
N$378  (via drill 1)
  other vias: 25.24,4.7
N$379  (via drill 1)
  other vias: 22.7,4.7
N$380  (via drill 1)
  other vias: 20.16,4.7
N$381  (via drill 1)
  other vias: 17.62,4.7
N$382  (via drill 1)
  other vias: 15.08,4.7
N$383  (via drill 1)
  other vias: 12.54,4.7
N$384  (via drill 1)
  other vias: 10,4.7
N$385  (via drill 1)
  other vias: 7.46,4.7

### Text on the board
tPlace: 3.3V | 5V | 3.3V | 5V | IO3 | IO2 | IO4 | 2 | IO14 | 3 | 4 | IO17 | DOT-plus-SHIM v1.0 | IO15 | 5 | 6 | TOP SIDE | IO18 | IO27 | 7 | 8 | 9 | 10 | IO23 | IO22 | 11 | 12 | 13 | 14 | IO24 | IO10 | 15 | 16 | 17 | 18 | IO25 | IO9 | 19 | 20 | 21 | 22 | IO8 | IO11 | 23 | 24 | 25 | 26 | IO7 | IO0 | 27 | 28 | 29 | 30 | IO1 | IO5 | 31 | 32 | IO12 | IO6 | 33 | 34 | IO19 | 35 | 36 | IO13 | IO26 | IO16 | 37 | 38 | IO21 | 39 | 40 | IO20 | GND
bPlace: http://redscorp.net | (c) Andriy Golovnya | BOTTOM SIDE